# EAGLE design optics_r001 (EAGLE 7.7.0)
AUTHOR: Joshua Alexander; REVISION: R001
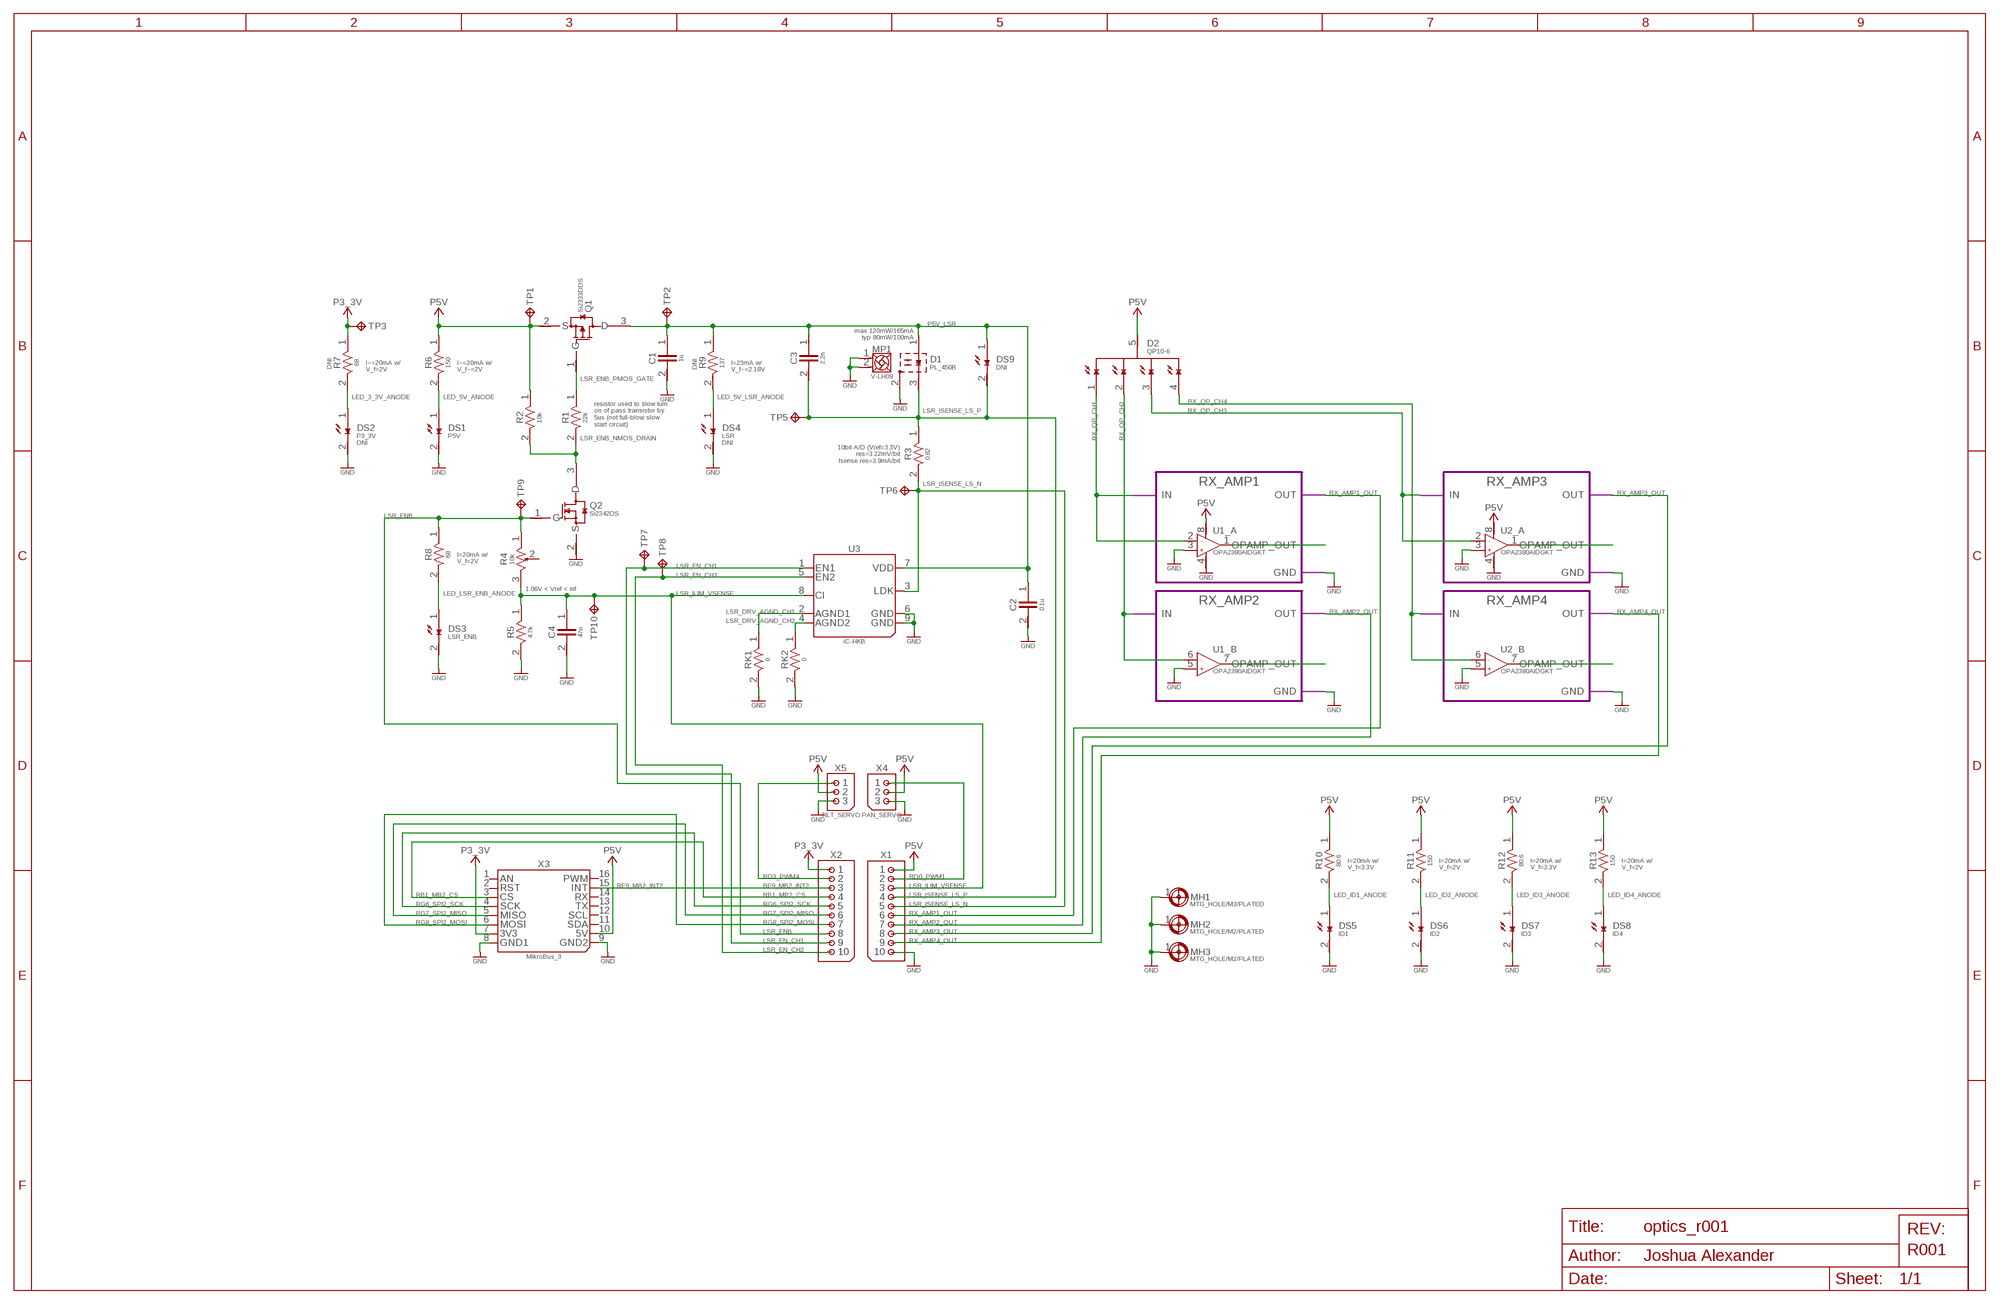
[diagram p0: schematic, sheet 1]

## Parts
C1  1u  C/10%/0805/10V  [0805_WAVE]
C2  0.1u  C/5%/0805/10V  [0805_WAVE]
C3  2.2n  C/1%/0805/10V  [0805_WAVE]
C4  47n  C/5%/0805/10V  [0805_WAVE]
D1  PL_450B  [TO38-ICUT-PL_450B]
D2  QP10-6  [TO5-QP10-6]
DS1  P5V  LED/YELLOW/1206/KINGBRIGHT  [1206_WAVE]
DS2  P3_3V  LED/YELLOW/1206/KINGBRIGHT  [1206_WAVE]
DS3  LSR_ENB  LED/RED/1206/KINGBRIGHT  [1206_WAVE]
DS4  LSR  LED/YELLOW/1206/KINGBRIGHT  [1206_WAVE]
DS5  ID1  LED/BLUE/1206/KINGBRIGHT  [1206_WAVE]
DS6  ID2  LED/RED/1206/KINGBRIGHT  [1206_WAVE]
DS7  ID3  LED/BLUE/1206/KINGBRIGHT  [1206_WAVE]
DS8  ID4  LED/YELLOW/1206/KINGBRIGHT  [1206_WAVE]
DS9  LED/BLUE/TH/5MM/CREE  [C503B-BAN/GAN/BCN/GCN]
MH1  MTG_HOLE/M3/PLATED  [M3_PLATED]
MH2  MTG_HOLE/M2/PLATED  [M2_PLATED]
MH3  MTG_HOLE/M2/PLATED  [M2_PLATED]
MP1  LENS_HOLDER/M9/LOW-PROFILE  [V-LH09]
Q1  MOSFET_P-TYPE/SI2333DDS  [SOT23-3]
Q2  MOSFET_N-TYPE/SI2342DS  [SOT23-3]
R1  22k  R/1%/0805/0.125W  [0805_WAVE]
R2  10k  R/1%/0805/0.125W  [0805_WAVE]
R3  0.82  R_SENSE/1%/1206/0.5W  [1206_WAVE]
R4  10k  R_POT/T93YB  [T93YB]
R5  4.7k  R/1%/0805/0.125W  [0805_WAVE]
R6  150  R/1%/0805/0.125W  [0805_WAVE]
R7  68  R/1%/0805/0.125W  [0805_WAVE]
R8  68  R/1%/0805/0.125W  [0805_WAVE]
R9  137  R/1%/0805/0.125W  [0805_WAVE]
R10  80.6  R/1%/0805/0.125W  [0805_WAVE]
R11  150  R/1%/0805/0.125W  [0805_WAVE]
R12  80.6  R/1%/0805/0.125W  [0805_WAVE]
R13  150  R/1%/0805/0.125W  [0805_WAVE]
RK1  0  R/1%/0805/0.125W  [0805_WAVE]
RK2  0  R/1%/0805/0.125W  [0805_WAVE]
TP1  TP/RECT_5X2.5  [PAD_RECT_5X2.5]
TP2  TP/RECT_5X2.5  [PAD_RECT_5X2.5]
TP3  TP/RECT_5X2.5  [PAD_RECT_5X2.5]
TP5  TP/CIRCLE_1.5  [PAD_CIRCLE_1.5]
TP6  TP/CIRCLE_1.5  [PAD_CIRCLE_1.5]
TP7  TP/OVAL_3X1.5  [PAD_OVAL_3X1.5]
TP8  TP/OVAL_3X1.5  [PAD_OVAL_3X1.5]
TP9  TP/CIRCLE_2  [PAD_CIRCLE_2]
TP10  TP/CIRCLE_1.5  [PAD_CIRCLE_1.5]
U1  OPA2380  [MSOP8]
U2  OPA2380  [MSOP8]
U3  iC-HKB  IC-HKB  [MSOP8-TP]
X1  HEADER-1X10/MALE/100MIL/TH/BREAKAWAY  [90120-0130]
X2  HEADER-1X10/MALE/100MIL/TH/BREAKAWAY  [90120-0130]
X3  MikroBus_3  MIKROE_BUS_CONN/SOCKET/NO_OUTLINE/COMPACT  [MIKROBUS_SOCKET_NO_OUTLINE_COMPACT]
X4  PAN_SERVO  HEADER-1X03/MALE/100MIL/TH/BREAKAWAY  [22-28-4030]
X5  TILT_SERVO  HEADER-1X03/MALE/100MIL/TH/BREAKAWAY  [22-28-4030]

## Module instances
RX_AMP1 = RX_AMP (part numbers offset by 100)
RX_AMP2 = RX_AMP (part numbers offset by 200)
RX_AMP3 = RX_AMP (part numbers offset by 300)
RX_AMP4 = RX_AMP (part numbers offset by 400)

## Nets
GND: C1.2 C2.2 C4.2 D1.2(CASE) DS1.2(C) DS2.2(C) DS3.2(C) DS4.2(C) DS5.2(C) DS6.2(C) DS7.2(C) DS8.2(C) MH1.1 MH2.1 MH3.1 MP1.1 MP1.2 Q2.2(S) R5.2 RK1.2 RK2.2 U1.3(_A:+IN) U1.4(V-) U1.5(_B:+IN) U2.3(_A:+IN) U2.4(V-) U2.5(_B:+IN) U3.6(GND) U3.9(GND) X1.10 X3.8(GND1) X3.9(GND2) X4.3 X5.3 ; port RX_AMP3.GND RX_AMP4.GND RX_AMP1.GND RX_AMP2.GND
LED_3_3V_ANODE: DS2.1(A) R7.2
LED_5V_ANODE: DS1.1(A) R6.2
LED_5V_LSR_ANODE [LSR_EN_CH]: DS4.1(A) R9.2
LED_ID1_ANODE: DS5.1(A) R10.2
LED_ID2_ANODE: DS6.1(A) R11.2
LED_ID3_ANODE: DS7.1(A) R12.2
LED_ID4_ANODE: DS8.1(A) R13.2
LED_LSR_ENB_ANODE: DS3.1(A) R8.2
LSR_DRV_AGND_CH1: RK1.1 U3.2(AGND1)
LSR_DRV_AGND_CH2: RK2.1 U3.4(AGND2)
LSR_EN_CH1 [LSR_EN_CH]: TP7.1 U3.1(EN1) X2.9
LSR_EN_CH2 [LSR_EN_CH]: TP8.1 U3.5(EN2) X2.10
LSR_ENB: Q2.1(G) R4.1 R8.1 TP9.1 X2.8
LSR_ENB_NMOS_DRAIN: Q2.3(D) R1.2 R2.2
LSR_ENB_PMOS_GATE: Q1.1(G) R1.1
LSR_ILIM_VSENSE: C4.1 R4.3 R5.1 TP10.1 U3.8(CI) X1.3
LSR_ISENSE_LS_N: R3.2 TP6.1 U3.3(LDK) X1.5
LSR_ISENSE_LS_P: C3.2 D1.3(C) DS9.2(C) R3.1 TP5.1 X1.4
P3_3V [PWR]: R7.1 TP3.1 X2.1 X3.7(3V3)
P5V [PWR]: D2.5(C) Q1.2(S) R2.1 R6.1 R10.1 R11.1 R12.1 R13.1 TP1.1 U1.8(V+) U2.8(V+) X1.1 X3.10(5V) X4.2 X5.2
P5V_LSR [PWR]: C1.1 C2.1 C3.1 D1.1(A) DS9.1(A) Q1.3(D) R9.1 TP2.1 U3.7(VDD)
RB1_MB2_CS: X2.4 X3.3(CS)
RD0_PWM1: X1.2 X4.1
RD3_PWM4: X2.2 X5.1
RE9_MB2_INT2: X2.3 X3.15(INT)
RG6_SPI2_SCK: X2.5 X3.4(SCK)
RG7_SPI2_MISO: X2.6 X3.5(MISO)
RG8_SPI2_MOSI: X2.7 X3.6(MOSI)
RX_AMP1_OUT: X1.6 ; port RX_AMP1.OUT
RX_AMP2_OUT: X1.7 ; port RX_AMP2.OUT
RX_AMP3_OUT: X1.8 ; port RX_AMP3.OUT
RX_AMP4_OUT: X1.9 ; port RX_AMP4.OUT
RX_OPAMP_OUT1: U1.1(_A:OUT) ; port RX_AMP1.OPAMP_OUT
RX_OPAMP_OUT2: U1.7(_B:OUT) ; port RX_AMP2.OPAMP_OUT
RX_OPAMP_OUT3: U2.1(_A:OUT) ; port RX_AMP3.OPAMP_OUT
RX_OPAMP_OUT4: U2.7(_B:OUT) ; port RX_AMP4.OPAMP_OUT
RX_QP_CH1 [RX_AMP_PRE]: D2.1 U1.2(_A:-IN) ; port RX_AMP1.IN
RX_QP_CH2 [RX_AMP_PRE]: D2.2 U1.6(_B:-IN) ; port RX_AMP2.IN
RX_QP_CH3 [RX_AMP_PRE]: D2.3 U2.2(_A:-IN) ; port RX_AMP3.IN
RX_QP_CH4 [RX_AMP_PRE]: D2.4 U2.6(_B:-IN) ; port RX_AMP4.IN
Unconnected: R4.2(WIPER) X3.1(AN) X3.2(RST) X3.11(SDA) X3.12(SCL) X3.13(TX) X3.14(RX) X3.16(PWM)

## Notes on the sheet
- max 120mW/165mA
  typ 80mW/100mA
- I~=20mA w/
  V_f=2V
- I~=20mA w/
  V_f~=2V
- I=23mA w/
  V_f~=2.18V
- resistor used to slow turn
  on of pass transistor by
  5us (not full-blow slow
  start circuit)
- 10bit A/D (Vref=3.3V)
  res=3.22mV/bit
  Isense res=3.9mA/bit
- I=20mA w/
  V_f=2V
- 1.06V < Vref < inf
- I=20mA w/
  V_f=3.3V
- I=20mA w/
  V_f=2V
- I=20mA w/
  V_f=3.3V
- I=20mA w/
  V_f=2V

## Library data of the parts
C1 = rcl:C; EAGLEUP: C0805;;; TOL: 10
C2 C4 = rcl:C; EAGLEUP: C0805;;; TOL: 5
C3 = rcl:C; EAGLEUP: C0805;;; TOL: 1
D1 = diode:PL_450B: Blue Single-mode Laser Diode http://www.osram-os.com/osram_os/en/products/product-catalog/laser-diodes/visible-laser/blue-laser/index.jsp; EAGLEUP: PL_450B;;; I_F: 100mA; MFR: OSRAM; MPN: PL_450B; PWR: 0.08
D2 = diode:QP10-6: Quadrant PIN photodiode (QP) http://www.first-sensor.com/en/products/optical-sensors/detectors/quadrant-pin-photodiodes-qp/; ACTIVE_AREA_PER: 2.45mm^2; EAGLEUP: QP10-6; I_PEAK: 10mA; MFR: First Sensor; MPN: QP10-6; V_MAX: 20V
DS1 DS8 = diode:LED; ANGLE: 120; EAGLEUP: LED1206_YELLOW;;; I_F: 20mA; LUM: 150mcd; MFR: Kingbright; MPN: APT3216SYCK; V_F: 2
DS2 DS4 = diode:LED; ANGLE: 120; DNI: DNI; EAGLEUP: LED1206_YELLOW;;; I_F: 20mA; LUM: 150mcd; MFR: Kingbright; MPN: APT3216SYCK; V_F: 2
DS3 DS6 = diode:LED; ANGLE: 120; EAGLEUP: LED1206_RED;;; I_F: 20mA; LUM: 150mcd; MFR: Kingbright; MPN: APT3216SURCK; V_F: 1.95
DS5 DS7 = diode:LED; ANGLE: 120; EAGLEUP: LED1206_BLUE;;; I_F: 20mA; LUM: 100mcd; MFR: Kingbright; MPN: APT3216QBC/D; V_F: 3.3
DS9 = diode:LED; ANGLE: 30; DNI: DNI; EAGLEUP: LED5MM_GREEN;;DNI; I_F: 30mA; LUM: 7065mcd; MFR: Cree; MPN: C503B-BCN-CV0Z0461; V_F: 3.2
MH1-MH3 = mechanical:MTG_HOLE
MP1 = mechanical:LENS_HOLDER; EAGLEUP: V-LH09;;; MFR: Marshall; MPN: V-LH09
Q1 = transistor:MOSFET_P-TYPE: P-Channel MOSFET; EAGLEUP: SOT23-3;;; MFR: Vishay; MPN: Si2333DDS; R_DS: 0.033; V_DS: -12; V_GS: 8; V_GS_TH: -0.7
Q2 = transistor:MOSFET_N-TYPE: N-Channel MOSFET; EAGLEUP: SOT23-3;;; MFR: Vishay; MPN: Si2342DS; R_DS: 0.018; V_DS: 8; V_GS: 5; V_GS_TH: 0.575
R1 R2 R5 R6 R8 R10-R13 RK1 RK2 = rcl:R; EAGLEUP: R0805;;; PWR: 0.125; TOL: 1
R3 = rcl:R_SENSE; EAGLEUP: R1206;;; PWR: 0.5; TOL: 1
R4 = rcl:R_POT: Possible values: 10 22 47 100 220 470 1k 2.2k 4.7k 10k 22k 47k 100k 220k 470k 1M 2.2M; EAGLEUP: T93YB;;; MFR: Vishay; MPN: T93YB103KT20; PWR: 0.5; TOL: 10; TURNS: 19
R7 R9 = rcl:R; DNI: DNI; EAGLEUP: R0805;;; PWR: 0.125; TOL: 1
TP1-TP3 TP5-TP10 = pad:TP
U1 U2 = ic:OPA2380: Transimpedance Amp http://www.ti.com/product/OPA2380; EAGLEUP: MSOP8;;; GBW: 90MHz; MFR: TI; MPN: OPA2380AIDGKT; VDD: 2.7-5.5
U3 = ic:IC-HK: Laser Switching Driver (155 MHz) https://www.ichaus.de/product/iC-HK%20iC-HKB; EAGLEUP: MSOP8;;; I_MAX: 300mA; MFR: iC-Haus; MPN: iC-HKB; VDD: 5
X1 X2 = io:HEADER-1X10; CIRCUITS: 10; EAGLEUP: HEADER_MALE_1X10;;; MFR: Molex; MPN: 90120-0130
X3 = io:MIKROE_BUS_CONN; CIRCUITS: 16; EAGLEUP: MIKROBUS_SOCKET;;; MFR: Molex; MPN: 90147-1108,90147-1108
X4 X5 = io:HEADER-1X03; CIRCUITS: 3; EAGLEUP: HEADER_MALE_1X03;;; MFR: Molex; MPN: 22-28-4030

## Module RX_AMP
Ports: IN(in) OPAMP_OUT(pas) OUT(out) GND(pwr)
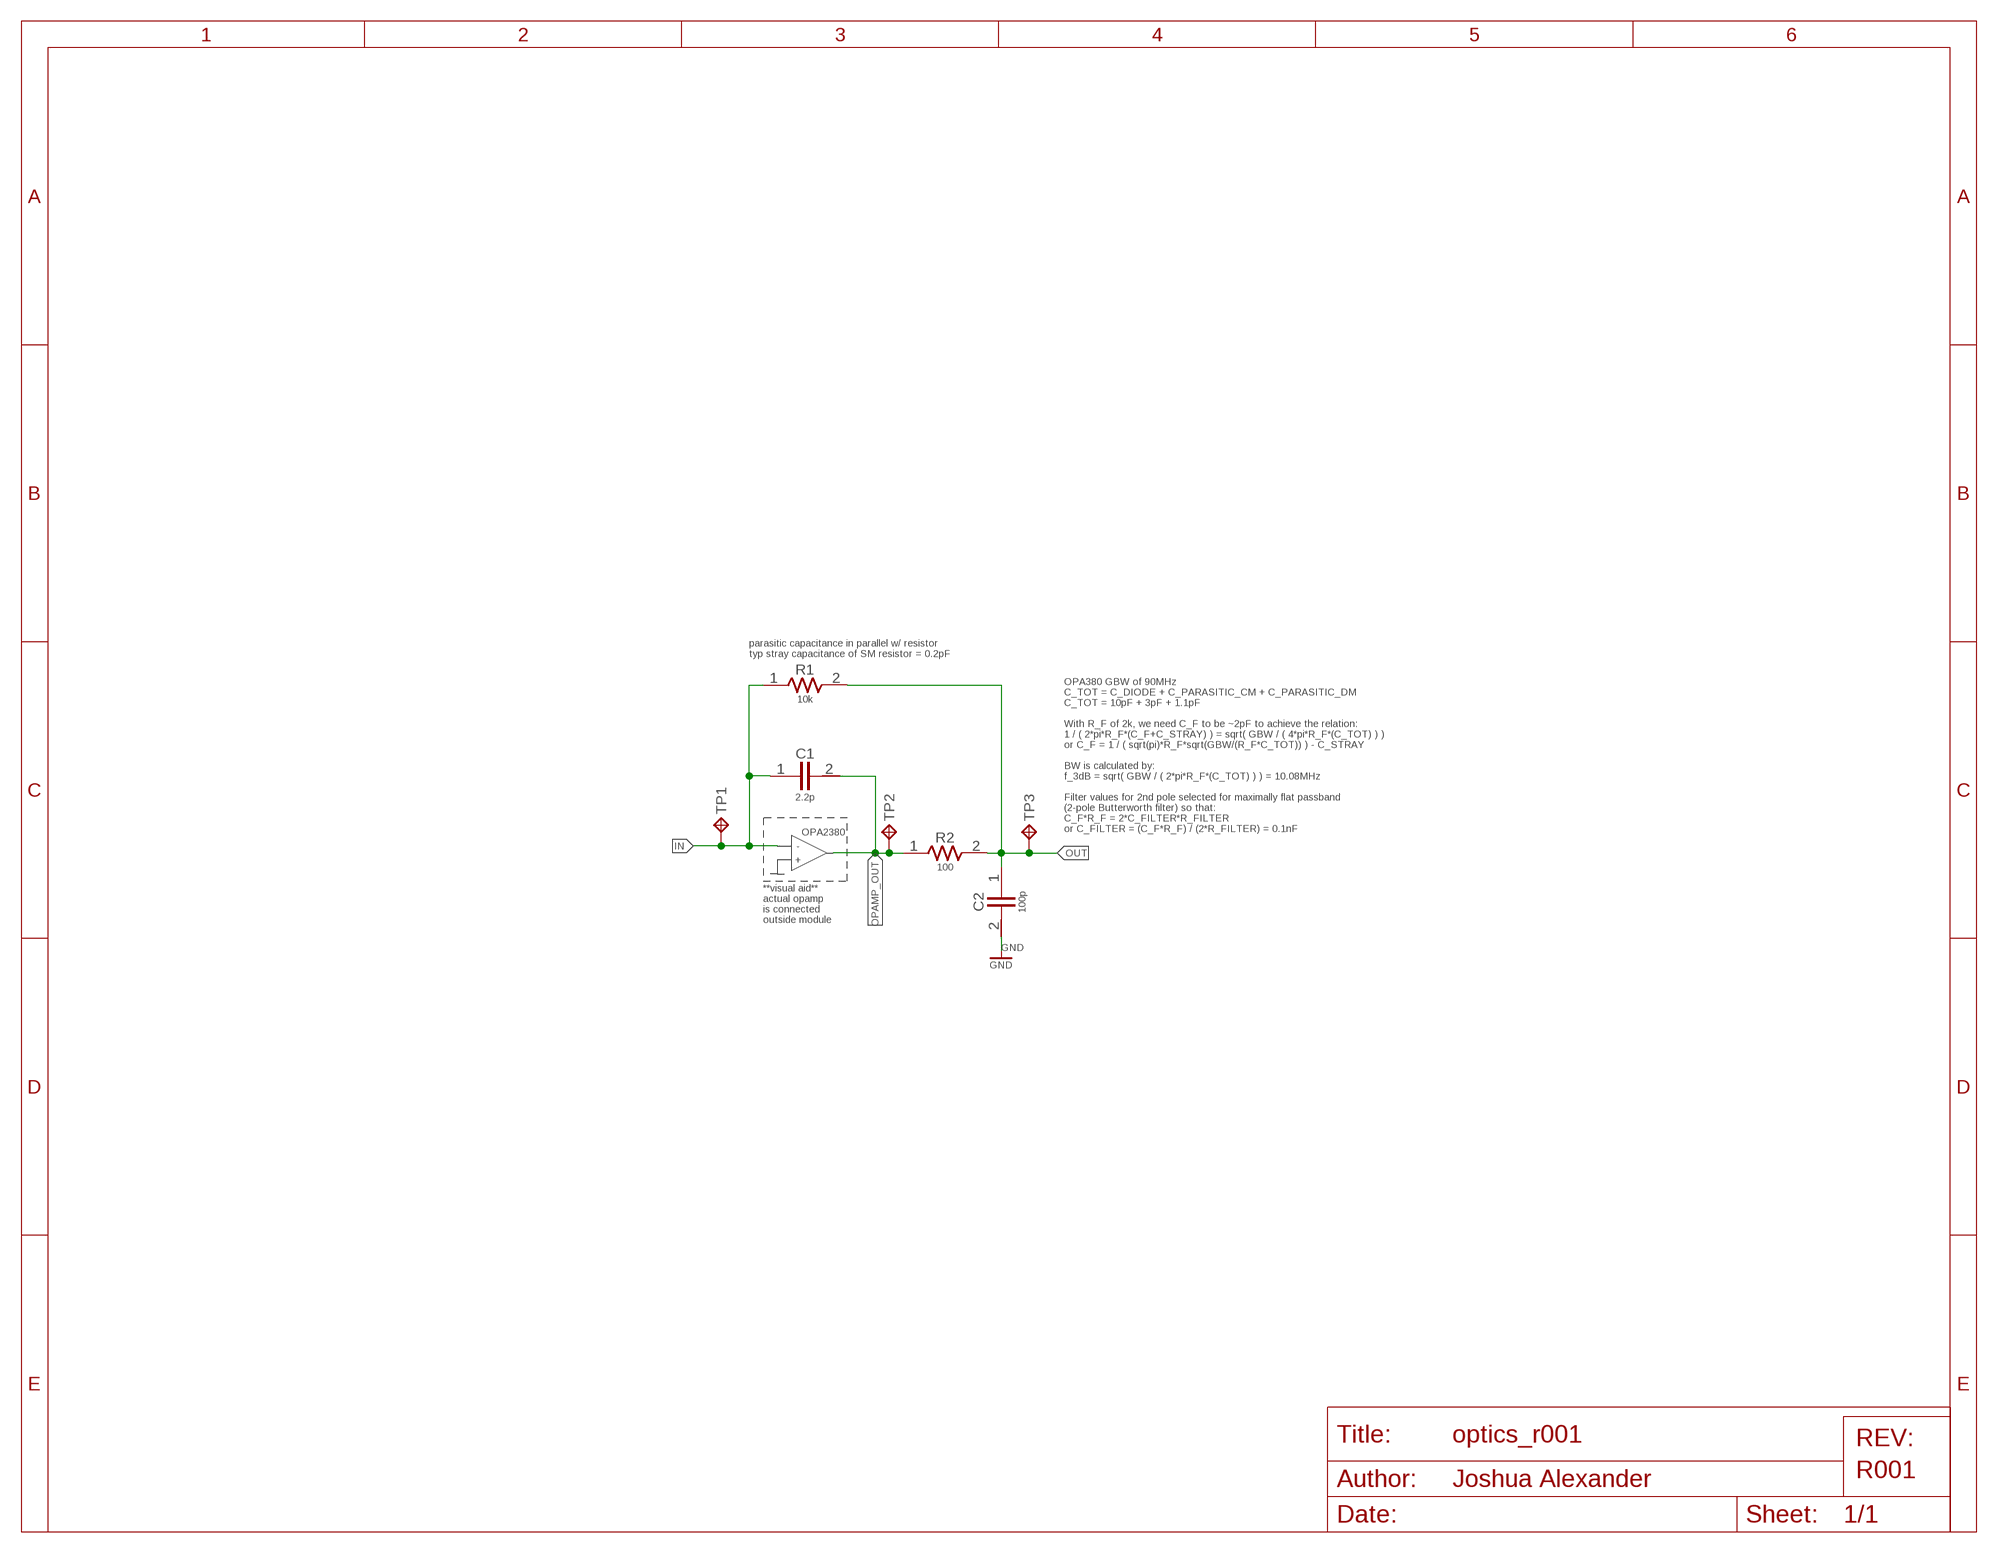
[diagram p1: schematic, module RX_AMP, sheet 1]

### Parts
C1  2.2p  C/1%/0805/10V  [0805_WAVE]
C2  100p  C/2%/0805/10V  [0805_WAVE]
R1  10k  R/1%/0805/0.125W  [0805_WAVE]
R2  100  R/1%/0805/0.125W  [0805_WAVE]
TP1  TP/CIRCLE_1.5  [PAD_CIRCLE_1.5]
TP2  TP/CIRCLE_1.5  [PAD_CIRCLE_1.5]
TP3  TP/CIRCLE_2  [PAD_CIRCLE_2]

### Nets
GND: C2.2
IN: C1.1 R1.1 TP1.1
OPAMP_OUT: C1.2 R2.1 TP2.1
OUT: C2.1 R1.2 R2.2 TP3.1

### Notes on the sheet
- parasitic capacitance in parallel w/ resistor
  typ stray capacitance of SM resistor = 0.2pF
- OPA380 GBW of 90MHz
  C_TOT = C_DIODE + C_PARASITIC_CM + C_PARASITIC_DM
  C_TOT = 10pF + 3pF + 1.1pF
   
  With R_F of 2k, we need C_F to be ~2pF to achieve the relation:
  1 / ( 2*pi*R_F*(C_F+C_STRAY) ) = sqrt( GBW / ( 4*pi*R_F*(C_TOT) ) )
  or C_F = 1 / ( sqrt(pi)*R_F*sqrt(GBW/(R_F*C_TOT)) ) - C_STRAY
   
  BW is calculated by:
  f_3dB = sqrt( GBW / ( 2*pi*R_F*(C_TOT) ) ) = 10.08MHz
   
  Filter values for 2nd pole selected for maximally flat passband 
  (2-pole Butterworth filter) so that:
  C_F*R_F = 2*C_FILTER*R_FILTER
  or C_FILTER = (C_F*R_F) / (2*R_FILTER) = 0.1nF
- OPA2380
- -
- +
- **visual aid**
  actual opamp
  is connected
  outside module

### Library data of the parts
C1 = rcl:C; EAGLEUP: C0805;;; TOL: 1
C2 = rcl:C; EAGLEUP: C0805;;; TOL: 2
R1 R2 = rcl:R; EAGLEUP: R0805;;; PWR: 0.125; TOL: 1
TP1-TP3 = pad:TP

## Net classes
0 default: width 0.203 mm, clearance 0.152 mm
1 PWR: width 0.305 mm, clearance 0.152 mm
2 RX_AMP_PRE: clearance 0.152 mm
3 LSR_EN_CH: clearance 0.152 mm

## Board
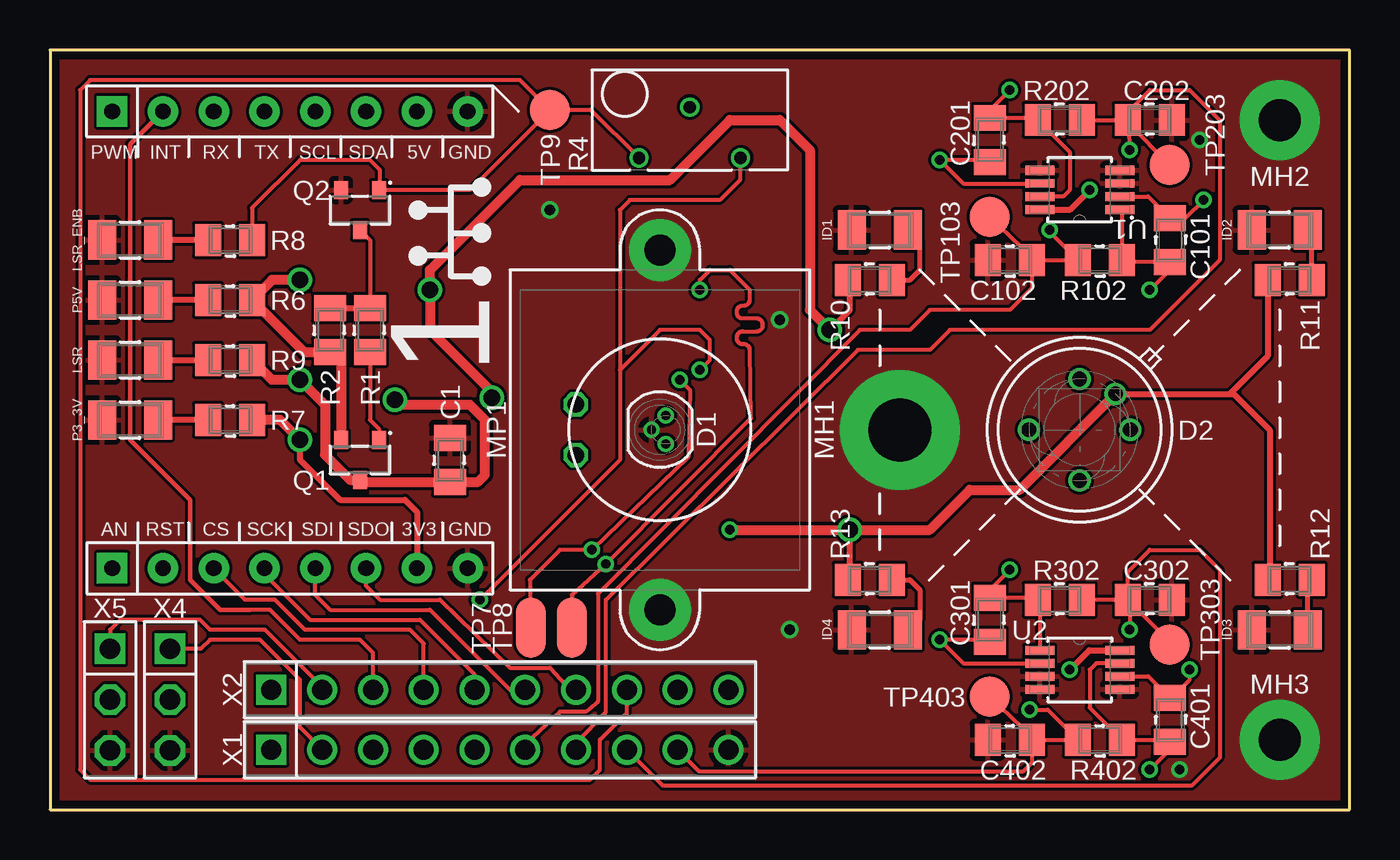
[diagram p2: board, top side]
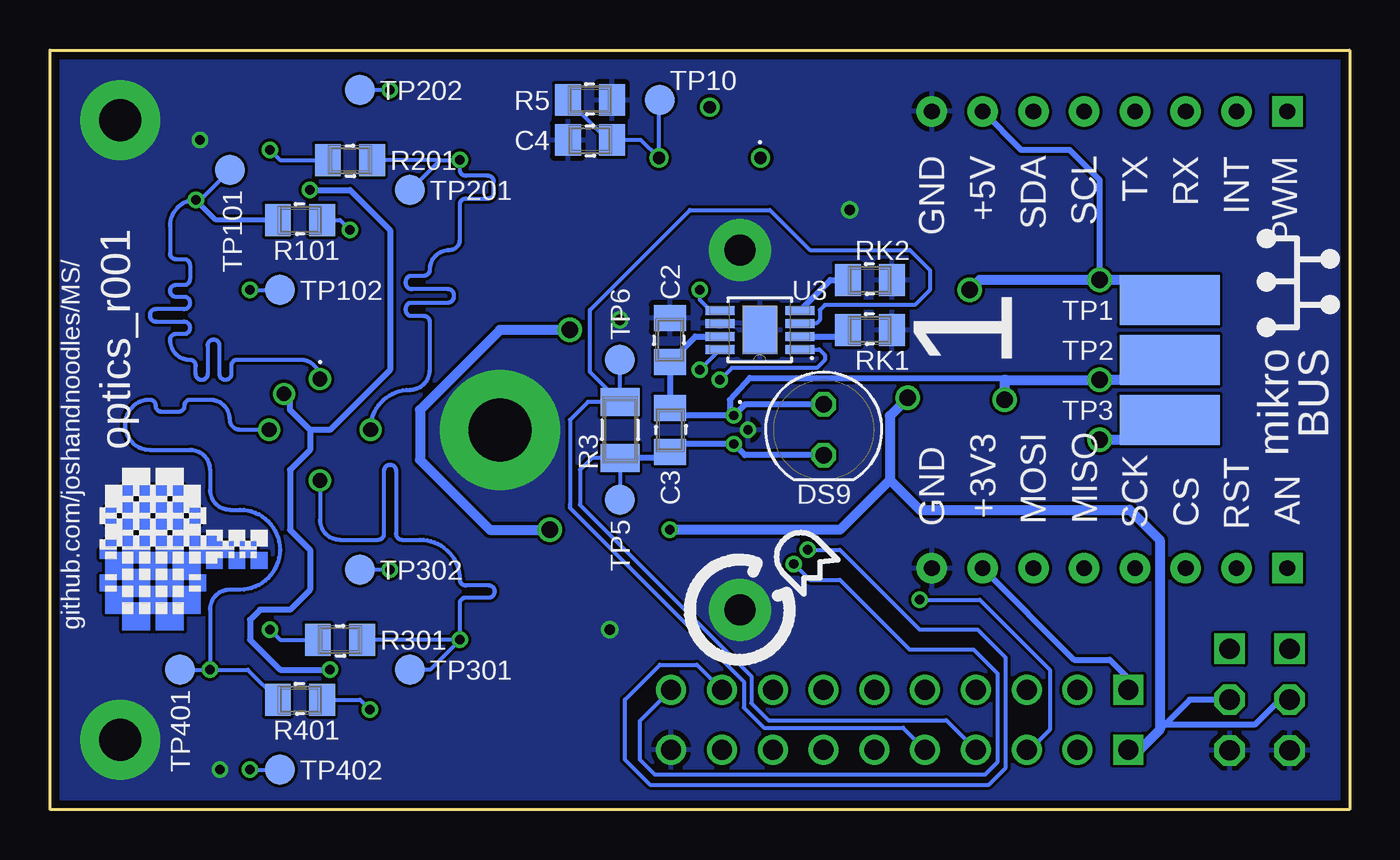
[diagram p3: board, bottom side, seen from below]

Size 65 x 38 mm. Coordinates in mm from the lower left corner, seen from the top.
Outline: 0,0 65,0 65,38 0,38 0,0
Copper layers (1*16): Top 0.0356mm / dielectric 1.5011mm / Bottom 0.0356mm
Design rules "optics_r001": minimum track width 6mil, minimum drill 13mil, track to track 6mil, track to pad 6mil, pad to pad 6mil, via to via 6mil, smd to smd 6mil, copper to edge 15mil, drill to drill 6mil, minimum pad ring 7mil, minimum via ring 7mil, stop-mask expansion 2.5mil, vias tented up to drill 9999mil, thermal gap 10mil

### Footprints (pad centres in the part's own frame; a part is rotated, then mirrored left to right if it is on the bottom)
0805_WAVE = smd 1.3 x 1.6: 1 1.1,0; 2 -1.1,0
TO38-ICUT-PL_450B = drill 0.457 pad 0.813: 1 -0.715,0.3; 2 0,-0.415; 3 0.715,0.3
TO5-QP10-6 = drill 0.737: 1 0,2.54; 2 -2.54,0; 3 0,-2.54; 4 2.54,0; 5 1.796,1.796
1206_WAVE = smd 1.4 x 1.95: 1 1.4,0; 2 -1.4,0
C503B-BAN/GAN/BCN/GCN = drill 0.813 octagon: 1 -1.27,0; 2 1.27,0
M3_PLATED = drill 3.15 pad 6: 1 0,0
M2_PLATED = drill 2.1 pad 4: 1 0,0
V-LH09 = drill 1.55 pad 3.1: 1 -9,0; 2 9,0
SOT23-3 = smd 0.7 x 0.9: 1 -0.95,-1; 2 0.95,-1; 3 0,1
T93YB = drill 0.61: 1 -1.9,2.54; 2 0.64,0; 3 -1.9,-2.54
PAD_RECT_5X2.5 = smd 5 x 2.5: 1 0,0
PAD_CIRCLE_1.5 = smd 1.5 x 1.5: 1 0,0
PAD_OVAL_3X1.5 = smd 3 x 1.5: 1 0,0
PAD_CIRCLE_2 = smd 2 x 2: 1 0,0
MSOP8 = smd 1.45 x 0.45: 1 -2,0.975; 2 -2,0.325; 3 -2,-0.325; 4 -2,-0.975; 5 2,-0.975; 6 2,-0.325; 7 2,0.325; 8 2,0.975
MSOP8-TP = smd 1.45 x 0.45: 1 -2,0.975; 2 -2,0.325; 3 -2,-0.325; 4 -2,-0.975; 5 2,-0.975; 6 2,-0.325; 7 2,0.325; 8 2,0.975 | smd 1.75 x 2.4: 9 0,0
90120-0130 = drill 1 square: 1 0,11.43 | drill 1: 2 0,8.89; 3 0,6.35; 4 0,3.81; 5 0,1.27; 6 0,-1.27; 7 0,-3.81; 8 0,-6.35; 9 0,-8.89; 10 0,-11.43
MIKROBUS_SOCKET_NO_OUTLINE_COMPACT = drill 0.787 pad 1.524 square: 1 -11.43,8.89; 16 11.43,8.89 | drill 0.787 pad 1.524: 2 -11.43,6.35; 3 -11.43,3.81; 4 -11.43,1.27; 5 -11.43,-1.27; 6 -11.43,-3.81; 7 -11.43,-6.35; 8 -11.43,-8.89; 9 11.43,-8.89; 10 11.43,-6.35; 11 11.43,-3.81; 12 11.43,-1.27; 13 11.43,1.27; 14 11.43,3.81; 15 11.43,6.35
22-28-4030 = drill 1.016 pad 1.524 square: 1 0,2.54 | drill 1.016 pad 1.524 octagon: 2 0,0; 3 0,-2.54

### Placement (x,y rotation side)
C1  20,17.5 270 top
C2  34,23.5 270 bottom
C3  34,19 90 bottom
C4  38,33.5 0 bottom
C101  2.2p  [0805_WAVE]  56,28.5 90 top
C102  100p  [0805_WAVE]  48,27.5 0 top
C201  2.2p  [0805_WAVE]  47,33.5 270 top
C202  100p  [0805_WAVE]  55,34.5 180 top
C301  2.2p  [0805_WAVE]  47,9.5 270 top
C302  100p  [0805_WAVE]  55,10.5 180 top
C401  2.2p  [0805_WAVE]  56,4.5 90 top
C402  100p  [0805_WAVE]  48,3.5 0 top
D1  30.5,19 270 top
D2  51.5,19 0 top
DS1  4,25.5 0 top
DS2  4,19.5 0 top
DS3  4,28.5 0 top
DS4  4,22.5 0 top
DS5  41.5,29 0 top
DS6  61.5,29 0 top
DS7  61.5,9 0 top
DS8  41.5,9 0 top
DS9  26.3,19 270 bottom
MH1  42.5,19 90 top
MH2  61.5,34.5 180 top
MH3  61.5,3.5 0 top
MP1  30.5,19 90 top
Q1  15.5,17.5 180 top
Q2  15.5,30 180 top
R1  16,24 270 top
R2  14,24 270 top
R3  36.5,19 270 bottom
R4  32,34.5 90 top
R5  38,35.5 180 bottom
R6  9,25.5 0 top
R7  9,19.5 0 top
R8  9,28.5 0 top
R9  9,22.5 0 top
R10  41,26.5 180 top
R11  62,26.5 180 top
R12  62,11.5 180 top
R13  41,11.5 180 top
R101  10k  [0805_WAVE]  52.5,29.5 180 bottom
R102  100  [0805_WAVE]  52.5,27.5 0 top
R201  10k  [0805_WAVE]  50,32.5 0 bottom
R202  100  [0805_WAVE]  50.5,34.5 180 top
R301  10k  [0805_WAVE]  50.5,8.5 0 bottom
R302  100  [0805_WAVE]  50.5,10.5 180 top
R401  10k  [0805_WAVE]  52.5,5.5 180 bottom
R402  100  [0805_WAVE]  52.5,3.5 0 top
RK1  24,24 180 bottom
RK2  24,26.5 180 bottom
TP1  9,25.5 180 bottom
TP2  9,22.5 180 bottom
TP3  9,19.5 180 bottom
TP5  36.5,15.5 270 bottom
TP6  36.5,22.5 90 bottom
TP7  24.05,9.1 90 top
TP8  26.1,9.1 90 top
TP9  25,35 270 top
TP10  34.5,35.5 0 bottom
TP101  [PAD_CIRCLE_1.5]  56,32 90 bottom
TP102  [PAD_CIRCLE_1.5]  53.5,26 0 bottom
TP103  [PAD_CIRCLE_2]  47,29.65 180 top
TP201  [PAD_CIRCLE_1.5]  47,31 0 bottom
TP202  [PAD_CIRCLE_1.5]  49.5,36 0 bottom
TP203  [PAD_CIRCLE_2]  56,32.25 0 top
TP301  [PAD_CIRCLE_1.5]  47,7 0 bottom
TP302  [PAD_CIRCLE_1.5]  49.5,12 0 bottom
TP303  [PAD_CIRCLE_2]  56,8.25 0 top
TP401  [PAD_CIRCLE_1.5]  58.5,7 270 bottom
TP402  [PAD_CIRCLE_1.5]  53.5,2 0 bottom
TP403  [PAD_CIRCLE_2]  47,5.65 180 top
U1  51.5,31 180 top
U2  51.5,7 0 top
U3  29.5,24 180 bottom
X1  22.5,3 90 top
X2  22.5,6 90 top
X3  12,23.5 90 top
X4  6,5.5 0 top
X5  3,5.5 0 top

### Tracks (layer width: path | path; a pad name or v marks a point on that pad's centre or on a via)
GND  (via drill 0.46, 0.51)
  other vias: 56.5,2 57.5,33.5 36.5,24.5 25,30 37,9
  pour Top: 0,0 0,38 65,38 65,0
  pour Bottom: 0,0 65,0 65,38 0,38
LED_3_3V_ANODE
  Top 0.305: R7.2 DS2.1
LED_5V_ANODE
  Top 0.305: R6.2 DS1.1
LED_5V_LSR_ANODE
  Top 0.305: DS4.1 R9.2
LED_ID1_ANODE
  Top 0.254: R10.2 43,26.5 43.5,27 43.5,28.4 DS5.1
LED_ID2_ANODE
  Top 0.254: R11.2 63.1,28.8 DS6.1
LED_ID3_ANODE
  Top 0.254: DS7.1 62.9,11.3 R12.2
LED_ID4_ANODE
  Top 0.254: R13.2 43,11.5 43.5,11 43.5,9.5 43,9 DS8.1
LED_LSR_ENB_ANODE
  Top 0.305: R8.2 DS3.1
LSR_DRV_AGND_CH1
  Bottom 0.305: U3.2 25.43,23.68 RK1.1
LSR_DRV_AGND_CH2
  Bottom 0.305: U3.4 25.98,26.5 RK2.1
LSR_EN_CH1  (via drill 0.46)
  Top 0.203: v31.5,21.5 32,21 31.93,17.65 v27.1,13 25.5,13 24,11.5 24,9.15 TP7.1
  Bottom 0.203: X2.9 32.64,7.25 34.5,7.25 36.25,5.5 36.25,2.5 35,1.25 18.05,1.25 17.2,2.1 17.2,7.6 18.6,9 21.5,9 25.5,13 v27.1,13 | U3.1 26.52,23.02 26.25,22.75 26.25,22.5 26.65,22.1 30.9,22.1 v31.5,21.5
LSR_EN_CH2  (via drill 0.46)
  Top 0.203: v32.5,26 32.5,26.5 33,27 34,27 35,26 35,25.5 arc-90 34.71,25.21 34.65,25.21 arc90 34.35,24.92 34.35,24.86 arc90 34.65,24.57 35.35,24.57 arc-90 35.65,24.27 35.65,24.21 arc-90 35.35,23.92 34.65,23.92 arc90 34.35,23.63 34.35,23.57 arc90 34.65,23.28 34.71,23.28 arc-90 35,22.99 35.07,19.58 v27.8,12.28 26.1,10.75 TP8.1
  Bottom 0.203: U3.5 31.98,24.98 32.5,25.5 v32.5,26 | X2.10 35.5,4.43 35.5,2.5 34.75,1.75 18.25,1.75 17.6,2.4 17.6,6.8 18.8,8 22,8 25.5,11.5 26.99,11.5 v27.8,12.28
LSR_ENB
  Top 0.203: R4.1 27.06,35 TP9.1 | TP9.1 21,31 Q2.1 16.5,31.05 16.5,32 16,32.5 12.5,32.5 10.1,30.1 R8.1 | TP9.1 23.5,36.5 2,36.5 1.5,36 1.5,2 2,1.5 27,1.5 27.5,2 27.5,3.5 28.85,4.85 X2.8
LSR_ENB_NMOS_DRAIN
  Top 0.203: Q2.3 16,28.5 R1.2
  Top 0.305: R2.2 R1.2
LSR_ENB_PMOS_GATE
  Top 0.203: R1.1 16,19.5 16.45,19.05 Q1.1
LSR_ILIM_VSENSE  (via drill 0.46)
  Top 0.203: R4.3 34.5,32.56 34.5,31.5 33.5,30.5 29,30.5 28.5,30 28.5,22 | 28.5,22 28.5,17.5 v21.5,10.5 | v32.5,22 33,22.5 33,23.5 32.5,24 30.5,24 28.5,22
  Bottom 0.203: TP10.1 34.54,35.46 R4.3 35.44,33.5 C4.1 37.1,33.5 R5.1 | U3.8 32.5,22.02 v32.5,22 | v21.5,10.5 18.5,10.5 15,7 15,4 16,3 X1.3
LSR_ISENSE_LS_N
  Bottom 0.203: R3.2 TP6.1 | R3.2 38,21.9 38,25 33,30 29,30 27,28 22,28 21,27 21,26 21.75,25.25 26.25,25.25 26.5,25 26.5,24.5 26.68,24.32 U3.3 | R3.2 38.1,20.4 39,19.5 39,15.25 39,15.1 30.3,6.4 30.3,5.1 29.3,4.1 22.33,4.1 X1.5
LSR_ISENSE_LS_P
  Bottom 0.203: C3.2 34.3,17.6 | TP5.1 R3.1 37.9,17.6 38.5,17 38.5,15.25 29.92,6.67 29.92,5.32 29.07,4.47 20.16,4.47 X1.4
  Bottom 0.305: 34.3,17.6 R3.1 | DS9.2 30.25,17.73 D1.3 33.62,18.29 C3.2
P3_3V  (via drill 0.81)
  Top 0.305: X3.7 18.35,14.9 17.75,15.5 14.5,15.5 12.5,17.5 v12.5,18.5
  Top 0.508: v12.5,18.5 11.5,19.5 R7.1
  Bottom 0.305: X3.7 13.78,7.5 12,7.5 11.07,6.57 X2.1
  Bottom 0.508: TP3.1 10,18.5 v12.5,18.5
P5V  (via drill 0.46, 0.81)
  Top 0.305: R2.1 14.55,22.35 | Q1.2 14.5,18.5 14.5,20 | U1.8 51.02,30.02 v52,31 | v51,7 51.98,7.97 U2.8 | v39,24 40,25 40,26.4 R10.1 | R13.1 40,11.6 v40,14 | D2.5 59,20.8 | 59,20.8 59.2,20.8 61,19 61,11.6 R12.1 | R11.1 60.9,22.7 59,20.8
  Top 0.508: R2.1 12.7,22.9 R6.1 11.1,26.5 v12.5,26.5 | 14.55,22.35 Q1.2 | v34,14 v40,14 44,14 46,16 48.5,16 D2.5 | v39,24 38,25 38,33 36.5,34.5 34,34.5 31,31.5 23.5,31.5 19,27 v19,26 19,24 22.1,20.9 v22.1,20.6
  Bottom 0.305: v12.5,26.5 12.5,31.5 14,33 16.42,33 X3.10 | 10.5,3 X1.1 | X4.2 8,5.5 9.25,4.25 | X5.2 3.5,5.5 4.75,4.25 9.25,4.25 | 9.25,4.25 9.5,4 | v52,31 50,31 48,29 48,22 51,19 52,19 | 52,19 53,20 53,20.5 D2.5 | v51,7 53.5,7 55,8.5 55,9.5 54.5,10 53,10 52,11 52,13 53,14 53,17 52,18 52,19
  Bottom 0.508: TP1.1 10,26.5 v12.5,26.5 18.5,26.5 v19,26 | 10.5,3 9.5,4 9.5,13.5 11,15 21.5,15 23,16.5 | 23,16.5 23,19.7 v22.1,20.6 | 23,16.5 25.5,14 v34,14 | v39,24 42.5,24 46.5,20 46.5,17.5 43,14 v40,14
P5V_LSR  (via drill 0.81)
  Top 0.305: Q1.3 15.6,16.4
  Top 0.508: 15.6,16.4 C1.1 21.4,16.4 21.75,16.75 21.75,19.5 21,20.25 17.5,20.25 v17.25,20.5 | R9.1 11.1,21.5 v12.5,21.5 13.75,20.25 13.75,17.75 15,16.5 Q1.3
  Bottom 0.305: U3.7 32.73,23.68 C2.1 C3.1 33.62,19.71 D1.1 | DS9.1 30.25,20.27 D1.1 | D1.1 31,19.91 31,20.5 30,21.6 17.3,21.6 17.2,21.5
  Bottom 0.508: TP2.1 10,21.5 v12.5,21.5 17.2,21.5 17.25,21.5 v17.25,20.5
RB1_MB2_CS
  Top 0.203: X2.4 18.69,8.31 18,9 12.76,9 11.26,10.5 9.76,10.5 X3.3
RD0_PWM1
  Top 0.203: X1.2 12.5,4.11 12.5,6.5 10.5,8.5 8,8.5 7.54,8.04 X4.1
RD3_PWM4
  Top 0.203: X2.2 13.61,6.39 13.5,6.5 13.25,6.5 10.75,9 8,9 7.5,9.5 3.5,9.5 3,9 X5.1
RE9_MB2_INT2
  Top 0.203: X2.3 16.15,7.85 15.5,8.5 12.5,8.5 11,10 10,10
  Top 0.229: 10,10 8.5,10 7,11.5 7,15.5 4,18.5 4,33.28 X3.15
RG6_SPI2_SCK
  Top 0.203: X3.4 10.73,11.77 13,9.5 18.5,9.5 21.23,6.77 X2.5 21.23,6.27
RG7_SPI2_MISO
  Top 0.203: X3.5 13.27,10.73 14,10 19,10 23,6 X2.6
RG8_SPI2_MOSI
  Top 0.203: X3.6 15.81,11.19 16.5,10.5 19.5,10.5 23,7.1 25,7.1 26,6 X2.7
RX_AMP1_OUT  (via drill 0.46)
  Top 0.203: C102.1 R102.2 50,28.9 v50,29 | C102.1 49.1,27.65 TP103.1 | C102.1 49.1,26.1 48,25 44,25 43,24 40.5,24 27.4,10.8 27.4,5.4 26.8,4.9 25.5,4.9 23.77,3.27 X1.6
  Bottom 0.203: R101.2 50.5,29.5 v50,29
RX_AMP2_OUT  (via drill 0.46)
  Top 0.203: R202.2 C202.1 | C202.1 53.9,34.35 TP203.1 | C202.1 v54,33 | C202.1 53.9,34.9 55,36 57,36 58.5,34.5 58.5,27.5 55,24 45,24 44,23 40.4,23 27.8,10.5 27.8,4.9 26.31,3.31 X1.7
  Bottom 0.203: v54,33 53.5,32.5 R201.2
RX_AMP3_OUT  (via drill 0.46)
  Top 0.203: C302.1 56,8.4 TP303.1 | C302.1 R302.2 | C302.1 54,10.4 v54,9 | C302.1 53.9,11.9 55,13 57.5,13 58.5,12 58.5,2.6 57.1,1.2 30.65,1.2 X1.8
  Bottom 0.203: v54,9 53.5,8.5 R301.2
RX_AMP4_OUT  (via drill 0.46)
  Top 0.203: C402.1 R402.2 49.9,5 v49,5 | TP403.1 49.1,3.65 C402.1 | C402.1 49.1,2.35 48.65,1.9 32.49,1.9 X1.9
  Bottom 0.203: R401.2 49.5,5.5 v49,5
RX_OPAMP_OUT1  (via drill 0.46)
  Top 0.203: U1.1 53.6,30.02 R102.1 53.6,27.4 C101.2 56,27 v55,26
  Bottom 0.203: v55,26 TP102.1
RX_OPAMP_OUT2  (via drill 0.46)
  Top 0.203: v48,36 47,35 C201.2 49.4,34.6 R202.1 51,32.9 51,31 50.67,30.68 U1.7
  Bottom 0.203: v48,36 TP202.1
RX_OPAMP_OUT3  (via drill 0.46)
  Top 0.203: U2.1 49.5,10.5 R302.1 49.4,10.6 C301.2 47,11 v48,12
  Bottom 0.203: v48,12 TP302.1
RX_OPAMP_OUT4  (via drill 0.46)
  Top 0.203: v55,2 56,3 C401.2 56,3.5 R402.1 52,5.1 52,7 52.33,7.33 U2.7
  Bottom 0.203: v55,2 TP402.1
RX_QP_CH1  (via drill 0.46)
  Top 0.203: U1.2 54.92,30.68 C101.1 56.8,29.6 v57.7,30.5
  Bottom 0.203: TP101.1 57.5,30.5 v57.7,30.5 arc-90 59,29.2 59,27.83 arc-90 58.71,27.54 58.29,27.54 arc90 58,27.24 58,26.53 arc90 58.29,26.24 58.71,26.24 arc-90 59,25.95 arc-90 58.71,25.66 58.29,25.66 arc90 58,25.36 58,25.33 arc90 58.29,25.04 59.71,25.04 arc-90 60,24.74 60,24.71 arc-90 59.71,24.41 58.29,24.41 arc90 58,24.12 58,24.08 arc90 58.29,23.79 58.71,23.79 arc-90 59,23.5 arc-90 58,22.5 arc90 57.71,22.21 57.71,21.79 arc-90 57.42,21.49 57.41,21.49 arc-90 57.12,21.79 57.12,23.21 arc90 56.82,23.51 56.81,23.51 arc90 56.52,23.21 56.52,21.79 arc-90 56.23,21.49 56.22,21.49 arc-90 55.93,21.79 55.93,22.21 arc90 55.64,22.5 52.46,22.5 arc90 D2.1
  Bottom 0.254: R101.1 56.7,29.5 v57.7,30.5
RX_QP_CH2  (via drill 0.46)
  Top 0.203: C201.1 46.9,32.5 v44.5,32.5 45.67,31.32 U1.6
  Bottom 0.203: 45.5,32.5 R201.1 | TP201.1 45.5,32.5 | 45.5,32.5 v44.5,32.5 44.5,32 arc-90 44.21,31.71 43.1,31.71 arc90 42.8,31.42 42.8,30.86 arc90 43.1,30.57 44.21,30.57 arc-90 44.5,30.27 44.5,28.5 arc90 45,28 arc-90 46,27 arc90 46.29,26.71 46.91,26.71 arc-90 47.2,26.42 47.2,26.33 arc-90 46.91,26.04 45.09,26.04 arc90 44.8,25.74 44.8,25.65 arc90 45.09,25.36 46.91,25.36 arc-90 47.2,25.07 47.2,24.98 arc-90 46.91,24.69 46.29,24.69 arc90 46,24.4 46,22 arc90 47,21 arc-90 48.96,19.04 D2.2
RX_QP_CH3  (via drill 0.46)
  Top 0.203: C301.1 46.9,8.5 v44.5,8.5 45.67,7.33 U2.2
  Bottom 0.203: v44.5,8.5 R301.1 | v44.5,8.5 46,7 TP301.1 | D2.3 51.5,14.5 arc-90 50.5,13.5 48.58,13.5 arc-90 48.29,13.79 48.29,16.96 arc90 48,17.25 47.98,17.25 arc90 47.69,16.96 47.69,13.79 arc-90 47.4,13.5 46.5,13.5 arc90 44.5,11.5 arc-90 44.21,11.21 43.05,11.21 arc90 42.76,10.92 42.76,10.9 arc90 43.05,10.6 44.21,10.6 arc-90 44.5,10.31 v44.5,8.5
RX_QP_CH4  (via drill 0.46)
  Top 0.203: U2.6 54.92,6.67 C401.1 56.1,5.6 57,6.5 v57,7
  Bottom 0.203: v57,7 55.1,7 R401.1 | TP401.1 v57,7 | D2.4 55.5,19 arc90 56,19.5 arc-90 57,20.5 57.98,20.5 arc-90 58.28,20.21 58.28,20.19 arc90 58.57,19.9 59.42,19.9 arc90 59.71,20.19 59.71,20.21 arc-90 60,20.5 arc-180 60,18 58,18 arc90 57,17 57,16 arc-90 56,15 55.5,15 arc180 55.5,11 56,11 arc-90 57,10 v57,7
(copper drawn outside any net)
  shapes: Bottom area x89

### Text on the board
bPlace: optics_r001 | github.com/joshandnoodles/MS/